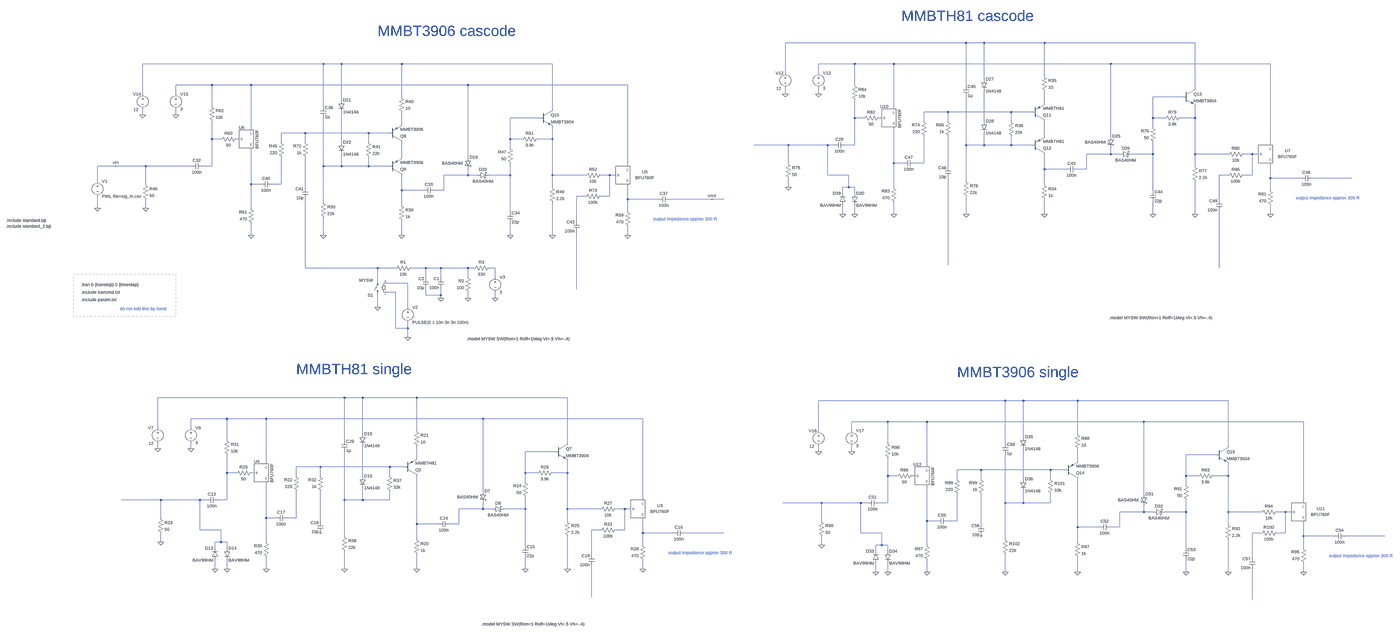
[diagram p0: schematic tp_study.asc, whole sheet]
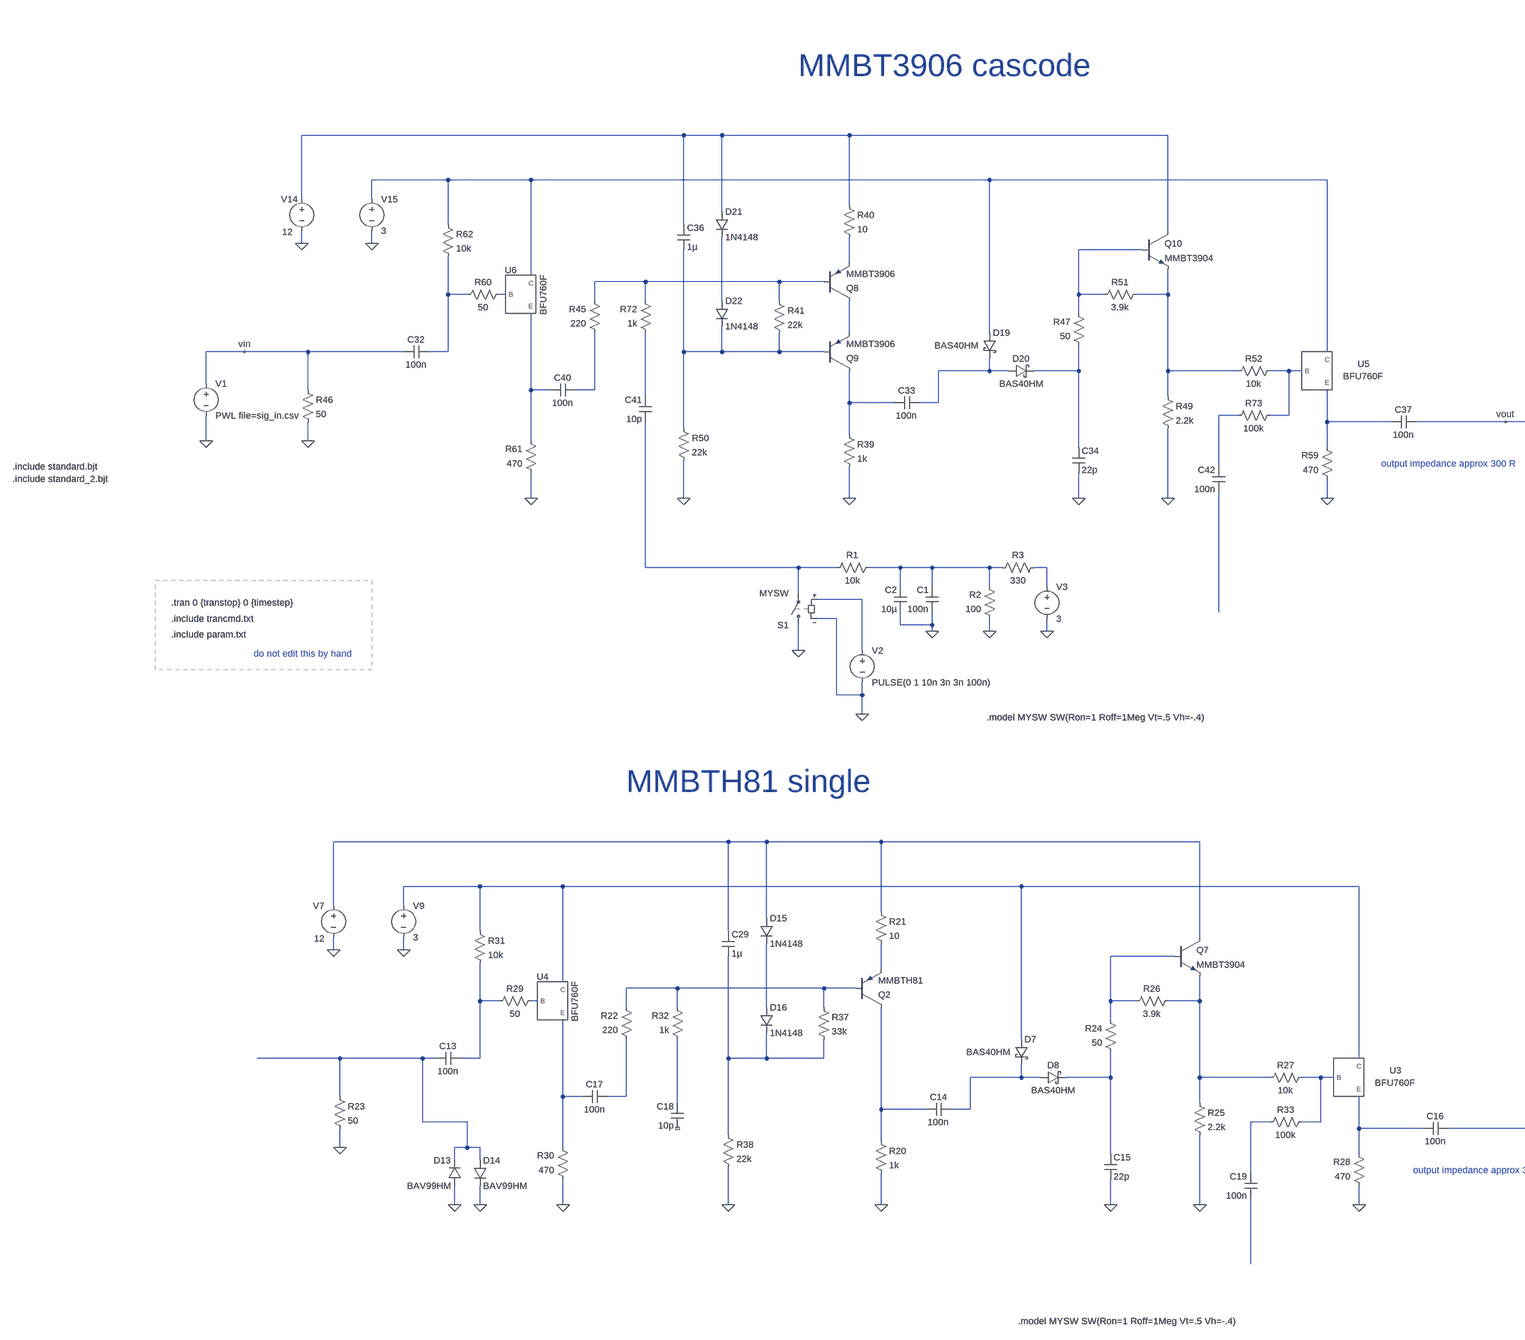
[diagram p1: schematic tp_study.asc, part, row 1 of 1, column 1 of 2]
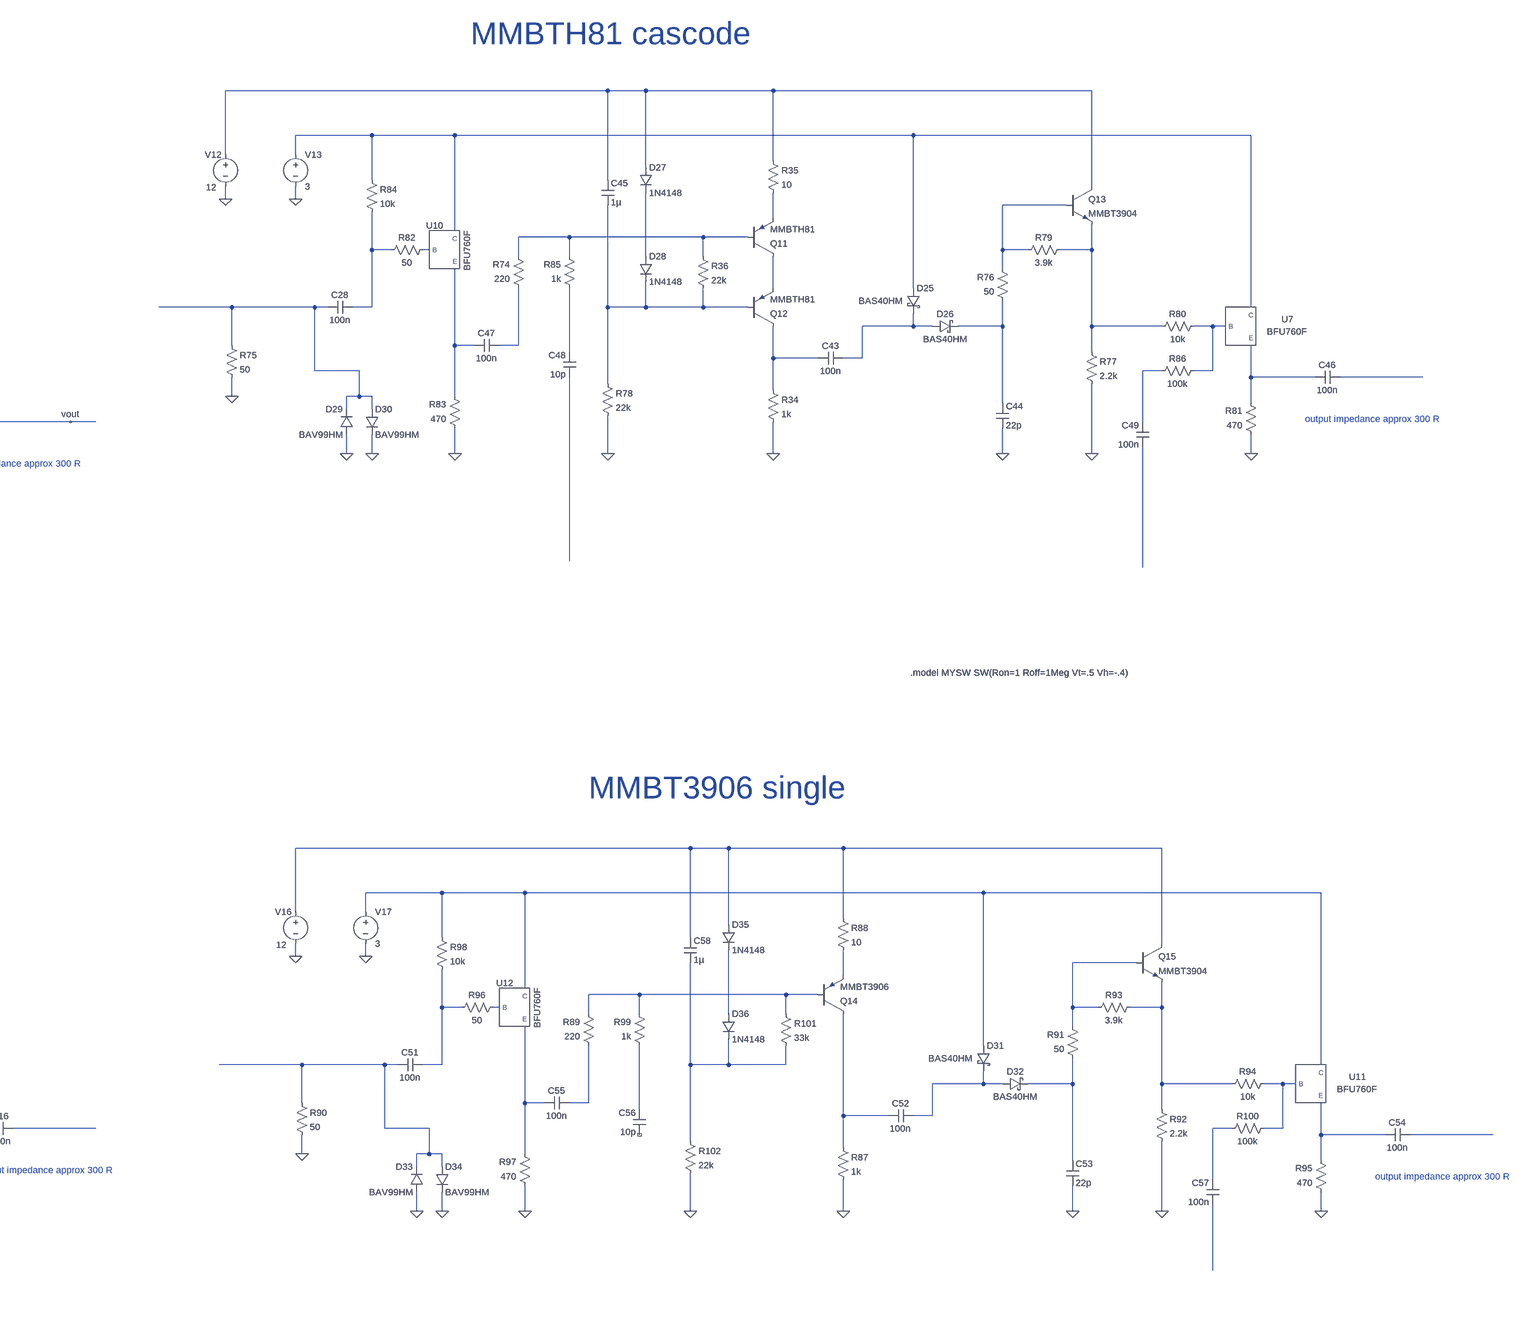
[diagram p2: schematic tp_study.asc, part, row 1 of 1, column 2 of 2]
tp_study.asc, the LTspice schematic file:
Version 4
SHEET 1 25452 10420
WIRE 23152 3536 22192 3536
WIRE 23248 3536 23152 3536
WIRE 23568 3536 23248 3536
WIRE 24368 3536 23568 3536
WIRE 19296 3648 18336 3648
WIRE 19392 3648 19296 3648
WIRE 19712 3648 19392 3648
WIRE 20512 3648 19712 3648
WIRE 22560 3648 22368 3648
WIRE 22768 3648 22560 3648
WIRE 23920 3648 22768 3648
WIRE 24768 3648 23920 3648
WIRE 22192 3696 22192 3536
WIRE 22368 3696 22368 3648
WIRE 23568 3712 23568 3536
WIRE 23248 3728 23248 3536
WIRE 18704 3760 18512 3760
WIRE 18912 3760 18704 3760
WIRE 20064 3760 18912 3760
WIRE 20912 3760 20064 3760
WIRE 22560 3760 22560 3648
WIRE 23152 3760 23152 3536
WIRE 24368 3776 24368 3536
WIRE 18336 3808 18336 3648
WIRE 18512 3808 18512 3760
WIRE 22192 3808 22192 3776
WIRE 22368 3808 22368 3776
WIRE 19712 3824 19712 3648
WIRE 24304 3824 24144 3824
WIRE 19392 3840 19392 3648
WIRE 23568 3856 23568 3792
WIRE 18704 3872 18704 3760
WIRE 19296 3872 19296 3648
WIRE 20512 3888 20512 3648
WIRE 22768 3888 22768 3648
WIRE 23056 3904 22928 3904
WIRE 23392 3904 23056 3904
WIRE 23504 3904 23392 3904
WIRE 18336 3920 18336 3888
WIRE 18512 3920 18512 3888
WIRE 20448 3936 20288 3936
WIRE 22560 3936 22560 3840
WIRE 22608 3936 22560 3936
WIRE 22704 3936 22688 3936
WIRE 24144 3936 24144 3824
WIRE 24208 3936 24144 3936
WIRE 24368 3936 24368 3872
WIRE 24368 3936 24288 3936
WIRE 22928 3952 22928 3904
WIRE 23056 3952 23056 3904
WIRE 23248 3952 23248 3792
WIRE 23392 3952 23392 3904
WIRE 19712 3968 19712 3904
WIRE 24144 3984 24144 3936
WIRE 18912 4000 18912 3760
WIRE 19200 4016 19072 4016
WIRE 19536 4016 19200 4016
WIRE 19648 4016 19536 4016
WIRE 23568 4032 23568 3952
WIRE 23920 4032 23920 3648
WIRE 18704 4048 18704 3952
WIRE 18752 4048 18704 4048
WIRE 18848 4048 18832 4048
WIRE 20288 4048 20288 3936
WIRE 20352 4048 20288 4048
WIRE 20512 4048 20512 3984
WIRE 20512 4048 20432 4048
WIRE 19072 4064 19072 4016
WIRE 19200 4064 19200 4016
WIRE 19392 4064 19392 3904
WIRE 19536 4064 19536 4016
WIRE 22208 4080 22000 4080
WIRE 22416 4080 22208 4080
WIRE 22448 4080 22416 4080
WIRE 22560 4080 22560 3936
WIRE 22560 4080 22512 4080
WIRE 23152 4080 23152 3824
WIRE 23248 4080 23248 4016
WIRE 23248 4080 23152 4080
WIRE 23392 4080 23392 4032
WIRE 23392 4080 23248 4080
WIRE 23504 4080 23392 4080
WIRE 24768 4080 24768 3648
WIRE 20288 4096 20288 4048
WIRE 23920 4128 23920 4096
WIRE 23920 4128 23792 4128
WIRE 23968 4128 23920 4128
WIRE 24144 4128 24144 4064
WIRE 24144 4128 24032 4128
WIRE 24368 4128 24368 3936
WIRE 24544 4128 24368 4128
WIRE 24672 4128 24624 4128
WIRE 24704 4128 24672 4128
WIRE 19712 4144 19712 4064
WIRE 20064 4144 20064 3760
WIRE 22208 4176 22208 4080
WIRE 22768 4176 22768 3984
WIRE 22816 4176 22768 4176
WIRE 22928 4176 22928 4032
WIRE 22928 4176 22880 4176
WIRE 18192 4192 18096 4192
WIRE 18352 4192 18192 4192
WIRE 18592 4192 18352 4192
WIRE 18704 4192 18704 4048
WIRE 18704 4192 18656 4192
WIRE 19296 4192 19296 3936
WIRE 19392 4192 19392 4128
WIRE 19392 4192 19296 4192
WIRE 19536 4192 19536 4144
WIRE 19536 4192 19392 4192
WIRE 19648 4192 19536 4192
WIRE 20912 4192 20912 3760
WIRE 23056 4192 23056 4032
WIRE 24368 4192 24368 4128
WIRE 23568 4208 23568 4128
WIRE 23680 4208 23568 4208
WIRE 23792 4208 23792 4128
WIRE 23792 4208 23744 4208
WIRE 20064 4240 20064 4208
WIRE 20064 4240 19936 4240
WIRE 20112 4240 20064 4240
WIRE 20288 4240 20288 4176
WIRE 20288 4240 20176 4240
WIRE 20512 4240 20512 4048
WIRE 20688 4240 20512 4240
WIRE 20816 4240 20768 4240
WIRE 20848 4240 20816 4240
WIRE 22416 4240 22416 4080
WIRE 22528 4240 22416 4240
WIRE 24544 4240 24496 4240
WIRE 24672 4240 24672 4128
WIRE 24672 4240 24624 4240
WIRE 24768 4256 24768 4176
WIRE 24928 4256 24768 4256
WIRE 25200 4256 24992 4256
WIRE 18096 4272 18096 4192
WIRE 23152 4272 23152 4080
WIRE 18352 4288 18352 4192
WIRE 18912 4288 18912 4096
WIRE 18960 4288 18912 4288
WIRE 19072 4288 19072 4144
WIRE 19072 4288 19024 4288
WIRE 23568 4288 23568 4208
WIRE 19200 4304 19200 4144
WIRE 20512 4304 20512 4240
WIRE 22208 4304 22208 4256
WIRE 22528 4304 22528 4240
WIRE 22528 4304 22496 4304
WIRE 22560 4304 22528 4304
WIRE 22768 4304 22768 4176
WIRE 19712 4320 19712 4240
WIRE 19824 4320 19712 4320
WIRE 19936 4320 19936 4240
WIRE 19936 4320 19888 4320
WIRE 24144 4320 24144 4128
WIRE 24768 4320 24768 4256
WIRE 22496 4336 22496 4304
WIRE 22560 4336 22560 4304
WIRE 20688 4352 20640 4352
WIRE 20816 4352 20816 4240
WIRE 20816 4352 20768 4352
WIRE 20912 4368 20912 4288
WIRE 21072 4368 20912 4368
WIRE 21360 4368 21136 4368
WIRE 21424 4368 21360 4368
WIRE 24496 4368 24496 4240
WIRE 19296 4384 19296 4192
WIRE 19712 4400 19712 4320
WIRE 18096 4416 18096 4352
WIRE 18352 4416 18352 4368
WIRE 18912 4416 18912 4288
WIRE 20288 4432 20288 4240
WIRE 20912 4432 20912 4368
WIRE 22496 4448 22496 4400
WIRE 22560 4448 22560 4400
WIRE 22768 4448 22768 4384
WIRE 23152 4448 23152 4352
WIRE 23568 4448 23568 4368
WIRE 24144 4448 24144 4384
WIRE 24368 4448 24368 4272
WIRE 24768 4448 24768 4400
WIRE 20640 4480 20640 4352
WIRE 18912 4560 18912 4496
WIRE 19296 4560 19296 4464
WIRE 19712 4560 19712 4480
WIRE 20288 4560 20288 4496
WIRE 20512 4560 20512 4384
WIRE 20912 4560 20912 4512
WIRE 23056 4784 23056 4256
WIRE 19200 4800 19200 4368
WIRE 19584 4800 19200 4800
WIRE 19680 4800 19584 4800
WIRE 19840 4800 19760 4800
WIRE 19920 4800 19840 4800
WIRE 20064 4800 19920 4800
WIRE 20096 4800 20064 4800
WIRE 20208 4800 20176 4800
WIRE 24496 4800 24496 4432
WIRE 19840 4848 19840 4800
WIRE 19920 4848 19920 4800
WIRE 20064 4848 20064 4800
WIRE 20208 4848 20208 4800
WIRE 19584 4864 19584 4800
WIRE 19744 4880 19632 4880
WIRE 20640 4912 20640 4544
WIRE 19680 4928 19632 4928
WIRE 19840 4944 19840 4912
WIRE 19920 4944 19920 4912
WIRE 19920 4944 19840 4944
WIRE 19920 4960 19920 4944
WIRE 20064 4960 20064 4928
WIRE 20208 4960 20208 4928
WIRE 19584 5008 19584 4944
WIRE 19744 5008 19744 4880
WIRE 19680 5120 19680 4928
WIRE 19744 5120 19744 5088
WIRE 19744 5120 19680 5120
WIRE 19744 5168 19744 5120
WIRE 19408 5664 18416 5664
WIRE 19504 5664 19408 5664
WIRE 19792 5664 19504 5664
WIRE 20592 5664 19792 5664
WIRE 23360 5680 22368 5680
WIRE 23456 5680 23360 5680
WIRE 23744 5680 23456 5680
WIRE 24544 5680 23744 5680
WIRE 18784 5776 18592 5776
WIRE 18992 5776 18784 5776
WIRE 20144 5776 18992 5776
WIRE 20992 5776 20144 5776
WIRE 22736 5792 22544 5792
WIRE 22944 5792 22736 5792
WIRE 24096 5792 22944 5792
WIRE 24944 5792 24096 5792
WIRE 18416 5824 18416 5664
WIRE 18592 5824 18592 5776
WIRE 19792 5840 19792 5664
WIRE 22368 5840 22368 5680
WIRE 22544 5840 22544 5792
WIRE 19504 5856 19504 5664
WIRE 23744 5856 23744 5680
WIRE 23456 5872 23456 5680
WIRE 18784 5888 18784 5776
WIRE 19408 5888 19408 5664
WIRE 20592 5904 20592 5664
WIRE 22736 5904 22736 5792
WIRE 23360 5904 23360 5680
WIRE 24544 5920 24544 5680
WIRE 18416 5936 18416 5904
WIRE 18592 5936 18592 5904
WIRE 20528 5952 20368 5952
WIRE 22368 5952 22368 5920
WIRE 22544 5952 22544 5920
WIRE 24480 5968 24320 5968
WIRE 19792 5984 19792 5920
WIRE 23744 6000 23744 5936
WIRE 18992 6016 18992 5776
WIRE 19280 6032 19152 6032
WIRE 19648 6032 19280 6032
WIRE 19728 6032 19648 6032
WIRE 22944 6032 22944 5792
WIRE 23232 6048 23104 6048
WIRE 23600 6048 23232 6048
WIRE 23680 6048 23600 6048
WIRE 18784 6064 18784 5968
WIRE 18832 6064 18784 6064
WIRE 18928 6064 18912 6064
WIRE 20368 6064 20368 5952
WIRE 20432 6064 20368 6064
WIRE 20592 6064 20592 6000
WIRE 20592 6064 20512 6064
WIRE 19152 6080 19152 6032
WIRE 19280 6080 19280 6032
WIRE 19504 6080 19504 5920
WIRE 19648 6080 19648 6032
WIRE 22736 6080 22736 5984
WIRE 22784 6080 22736 6080
WIRE 22880 6080 22864 6080
WIRE 24320 6080 24320 5968
WIRE 24384 6080 24320 6080
WIRE 24544 6080 24544 6016
WIRE 24544 6080 24464 6080
WIRE 23104 6096 23104 6048
WIRE 23232 6096 23232 6048
WIRE 23456 6096 23456 5936
WIRE 23600 6096 23600 6048
WIRE 20368 6112 20368 6064
WIRE 24320 6128 24320 6080
WIRE 20144 6160 20144 5776
WIRE 24096 6176 24096 5792
WIRE 18432 6208 18224 6208
WIRE 18640 6208 18432 6208
WIRE 18672 6208 18640 6208
WIRE 18784 6208 18784 6064
WIRE 18784 6208 18736 6208
WIRE 19408 6208 19408 5952
WIRE 19504 6208 19504 6144
WIRE 19504 6208 19408 6208
WIRE 19648 6208 19648 6160
WIRE 19648 6208 19504 6208
WIRE 20992 6208 20992 5776
WIRE 22384 6224 22176 6224
WIRE 22592 6224 22384 6224
WIRE 22624 6224 22592 6224
WIRE 22736 6224 22736 6080
WIRE 22736 6224 22688 6224
WIRE 23360 6224 23360 5968
WIRE 23456 6224 23456 6160
WIRE 23456 6224 23360 6224
WIRE 23600 6224 23600 6176
WIRE 23600 6224 23456 6224
WIRE 24944 6224 24944 5792
WIRE 20144 6256 20144 6224
WIRE 20144 6256 20016 6256
WIRE 20192 6256 20144 6256
WIRE 20368 6256 20368 6192
WIRE 20368 6256 20256 6256
WIRE 20592 6256 20592 6064
WIRE 20768 6256 20592 6256
WIRE 20896 6256 20848 6256
WIRE 20928 6256 20896 6256
WIRE 24096 6272 24096 6240
WIRE 24096 6272 23968 6272
WIRE 24144 6272 24096 6272
WIRE 24320 6272 24320 6208
WIRE 24320 6272 24208 6272
WIRE 24544 6272 24544 6080
WIRE 24720 6272 24544 6272
WIRE 24848 6272 24800 6272
WIRE 24880 6272 24848 6272
WIRE 18432 6304 18432 6208
WIRE 18992 6304 18992 6112
WIRE 19040 6304 18992 6304
WIRE 19152 6304 19152 6160
WIRE 19152 6304 19104 6304
WIRE 19280 6320 19280 6160
WIRE 20592 6320 20592 6256
WIRE 22384 6320 22384 6224
WIRE 22944 6320 22944 6128
WIRE 22992 6320 22944 6320
WIRE 23104 6320 23104 6176
WIRE 23104 6320 23056 6320
WIRE 19792 6336 19792 6080
WIRE 19904 6336 19792 6336
WIRE 20016 6336 20016 6256
WIRE 20016 6336 19968 6336
WIRE 23232 6336 23232 6176
WIRE 24544 6336 24544 6272
WIRE 23744 6352 23744 6096
WIRE 23856 6352 23744 6352
WIRE 23968 6352 23968 6272
WIRE 23968 6352 23920 6352
WIRE 18640 6368 18640 6208
WIRE 18752 6368 18640 6368
WIRE 20768 6368 20720 6368
WIRE 20896 6368 20896 6256
WIRE 20896 6368 20848 6368
WIRE 20992 6384 20992 6304
WIRE 21152 6384 20992 6384
WIRE 21424 6384 21216 6384
WIRE 22592 6384 22592 6224
WIRE 22704 6384 22592 6384
WIRE 24720 6384 24672 6384
WIRE 24848 6384 24848 6272
WIRE 24848 6384 24800 6384
WIRE 19408 6400 19408 6208
WIRE 24944 6400 24944 6320
WIRE 25104 6400 24944 6400
WIRE 25376 6400 25168 6400
WIRE 19792 6416 19792 6336
WIRE 23360 6416 23360 6224
WIRE 18432 6432 18432 6384
WIRE 18752 6432 18752 6368
WIRE 18752 6432 18720 6432
WIRE 18784 6432 18752 6432
WIRE 18992 6432 18992 6304
WIRE 23744 6432 23744 6352
WIRE 20368 6448 20368 6256
WIRE 20992 6448 20992 6384
WIRE 22384 6448 22384 6400
WIRE 22704 6448 22704 6384
WIRE 22704 6448 22672 6448
WIRE 22736 6448 22704 6448
WIRE 22944 6448 22944 6320
WIRE 18720 6464 18720 6432
WIRE 18784 6464 18784 6432
WIRE 24320 6464 24320 6272
WIRE 24944 6464 24944 6400
WIRE 22672 6480 22672 6448
WIRE 22736 6480 22736 6448
WIRE 20720 6496 20720 6368
WIRE 24672 6512 24672 6384
WIRE 18720 6576 18720 6528
WIRE 18784 6576 18784 6528
WIRE 18992 6576 18992 6512
WIRE 19408 6576 19408 6480
WIRE 19792 6576 19792 6496
WIRE 20368 6576 20368 6512
WIRE 20592 6576 20592 6400
WIRE 20992 6576 20992 6528
WIRE 22672 6592 22672 6544
WIRE 22736 6592 22736 6544
WIRE 22944 6592 22944 6528
WIRE 23360 6592 23360 6496
WIRE 23744 6592 23744 6512
WIRE 24320 6592 24320 6528
WIRE 24544 6592 24544 6416
WIRE 24944 6592 24944 6544
WIRE 20720 6928 20720 6560
WIRE 24672 6944 24672 6576
FLAG 19792 6576 0
FLAG 18432 6432 0
FLAG 20368 6576 0
FLAG 20592 6576 0
FLAG 20992 6576 0
FLAG 18784 6576 0
FLAG 18720 6576 0
FLAG 18592 5936 0
FLAG 18992 6576 0
FLAG 18416 5936 0
FLAG 19408 6576 0
FLAG 19712 4560 0
FLAG 18352 4416 0
FLAG 20288 4560 0
FLAG 19296 4560 0
FLAG 20512 4560 0
FLAG 20912 4560 0
FLAG 18512 3920 0
FLAG 18912 4560 0
FLAG 18336 3920 0
FLAG 23568 4448 0
FLAG 22208 4304 0
FLAG 24144 4448 0
FLAG 23152 4448 0
FLAG 24368 4448 0
FLAG 24768 4448 0
FLAG 22560 4448 0
FLAG 22496 4448 0
FLAG 22368 3808 0
FLAG 22768 4448 0
FLAG 22192 3808 0
FLAG 23744 6592 0
FLAG 22384 6448 0
FLAG 24320 6592 0
FLAG 24544 6592 0
FLAG 24944 6592 0
FLAG 22736 6592 0
FLAG 22672 6592 0
FLAG 22544 5952 0
FLAG 22944 6592 0
FLAG 22368 5952 0
FLAG 23360 6592 0
FLAG 18192 4192 vin
FLAG 18096 4416 0
FLAG 21360 4368 vout
FLAG 19584 5008 0
FLAG 19744 5168 0
FLAG 20208 4960 0
FLAG 20064 4960 0
FLAG 19920 4960 0
SYMBOL pnp 19728 6080 M180
SYMATTR InstName Q2
SYMATTR Value MMBTH81
SYMBOL res 19776 6400 R0
SYMATTR InstName R20
SYMATTR Value 1k
SYMBOL res 19776 5824 R0
SYMATTR InstName R21
SYMATTR Value 10
SYMBOL voltage 18416 5808 R0
WINDOW 123 0 0 Left 2
WINDOW 39 14 99 Left 2
WINDOW 0 -52 16 Left 2
WINDOW 3 -49 98 Left 2
SYMATTR InstName V7
SYMATTR Value 12
SYMBOL res 19168 6176 R180
WINDOW 0 36 76 Left 2
WINDOW 3 36 40 Left 2
SYMATTR InstName R22
SYMATTR Value 220
SYMBOL res 18416 6288 R0
SYMATTR InstName R23
SYMATTR Value 50
SYMBOL cap 18736 6192 R90
WINDOW 0 0 32 VBottom 2
WINDOW 3 32 32 VTop 2
SYMATTR InstName C13
SYMATTR Value 100n
SYMBOL cap 19968 6320 R90
WINDOW 0 0 32 VBottom 2
WINDOW 3 32 32 VTop 2
SYMATTR InstName C14
SYMATTR Value 100n
SYMBOL cap 20352 6448 R0
SYMATTR InstName C15
SYMATTR Value 22p
SYMBOL schottky 20128 6160 R0
WINDOW 3 -122 32 Left 2
SYMATTR Value BAS40HM
SYMATTR InstName D7
SYMATTR Description Diode
SYMATTR Type diode
SYMBOL schottky 20192 6272 R270
WINDOW 3 0 32 VBottom 2
WINDOW 0 32 32 VTop 2
SYMATTR Value BAS40HM
SYMATTR InstName D8
SYMATTR Description Diode
SYMATTR Type diode
SYMBOL res 20384 6208 R180
WINDOW 0 36 76 Left 2
WINDOW 3 36 40 Left 2
SYMATTR InstName R24
SYMATTR Value 50
SYMBOL res 20576 6304 R0
SYMATTR InstName R25
SYMATTR Value 2.2k
SYMBOL npn 20528 5904 R0
SYMATTR InstName Q7
SYMATTR Value MMBT3904
SYMBOL res 20528 6048 R90
WINDOW 0 0 56 VBottom 2
WINDOW 3 32 56 VTop 2
SYMATTR InstName R26
SYMATTR Value 3.9k
SYMBOL BFU760F 20960 6256 R0
SYMATTR InstName U3
SYMBOL res 20864 6240 R90
WINDOW 0 0 56 VBottom 2
WINDOW 3 32 56 VTop 2
SYMATTR InstName R27
SYMATTR Value 10k
SYMBOL res 21008 6544 R180
WINDOW 0 36 76 Left 2
WINDOW 3 36 40 Left 2
SYMATTR InstName R28
SYMATTR Value 470
SYMBOL cap 21216 6368 R90
WINDOW 0 0 32 VBottom 2
WINDOW 3 32 32 VTop 2
SYMATTR InstName C16
SYMATTR Value 100n
SYMBOL diode 18736 6528 R180
WINDOW 0 24 64 Left 2
WINDOW 3 24 0 Left 2
SYMATTR InstName D13
SYMATTR Value BAV99HM
SYMBOL diode 18768 6464 R0
SYMATTR InstName D14
SYMATTR Value BAV99HM
SYMBOL BFU760F 18960 6064 R0
WINDOW 0 -18 -46 Bottom 2
WINDOW 3 47 1 VTop 2
SYMATTR InstName U4
SYMBOL res 18928 6048 R90
WINDOW 0 0 56 VBottom 2
WINDOW 3 32 56 VTop 2
SYMATTR InstName R29
SYMATTR Value 50
SYMBOL res 19008 6528 R180
WINDOW 0 36 76 Left 2
WINDOW 3 36 40 Left 2
SYMATTR InstName R30
SYMATTR Value 470
SYMBOL voltage 18592 5808 R0
SYMATTR InstName V9
SYMATTR Value 3
SYMBOL cap 19104 6288 R90
WINDOW 0 0 32 VBottom 2
WINDOW 3 32 32 VTop 2
SYMATTR InstName C17
SYMATTR Value 100n
SYMBOL res 18768 5872 R0
SYMATTR InstName R31
SYMATTR Value 10k
SYMBOL res 19296 6176 R180
WINDOW 0 36 76 Left 2
WINDOW 3 36 40 Left 2
SYMATTR InstName R32
SYMATTR Value 1k
SYMBOL cap 19296 6384 R180
WINDOW 0 24 56 Left 2
WINDOW 3 24 8 Left 2
SYMATTR InstName C18
SYMATTR Value 10p
SYMBOL res 20864 6352 R90
WINDOW 0 0 56 VBottom 2
WINDOW 3 32 56 VTop 2
SYMATTR InstName R33
SYMATTR Value 100k
SYMBOL cap 20736 6560 R180
WINDOW 0 24 56 Left 2
WINDOW 3 24 8 Left 2
SYMATTR InstName C19
SYMATTR Value 100n
SYMBOL res 19632 6064 R0
SYMATTR InstName R37
SYMATTR Value 33k
SYMBOL diode 19488 5856 R0
SYMATTR InstName D15
SYMATTR Value 1N4148
SYMBOL diode 19488 6080 R0
SYMATTR InstName D16
SYMATTR Value 1N4148
SYMBOL cap 19392 5888 R0
SYMATTR InstName C29
SYMATTR Value 1µ
SYMBOL res 19392 6384 R0
SYMATTR InstName R38
SYMATTR Value 22k
SYMBOL pnp 19648 4064 M180
SYMATTR InstName Q8
SYMATTR Value MMBT3906
SYMBOL pnp 19648 4240 M180
SYMATTR InstName Q9
SYMATTR Value MMBT3906
SYMBOL res 19696 4384 R0
SYMATTR InstName R39
SYMATTR Value 1k
SYMBOL res 19696 3808 R0
SYMATTR InstName R40
SYMATTR Value 10
SYMBOL voltage 18336 3792 R0
WINDOW 123 0 0 Left 2
WINDOW 39 14 99 Left 2
WINDOW 0 -52 16 Left 2
WINDOW 3 -49 98 Left 2
SYMATTR InstName V14
SYMATTR Value 12
SYMBOL res 19520 4048 R0
SYMATTR InstName R41
SYMATTR Value 22k
SYMBOL res 19088 4160 R180
WINDOW 0 36 76 Left 2
WINDOW 3 36 40 Left 2
SYMATTR InstName R45
SYMATTR Value 220
SYMBOL res 18336 4272 R0
SYMATTR InstName R46
SYMATTR Value 50
SYMBOL cap 18656 4176 R90
WINDOW 0 0 32 VBottom 2
WINDOW 3 32 32 VTop 2
SYMATTR InstName C32
SYMATTR Value 100n
SYMBOL cap 19888 4304 R90
WINDOW 0 0 32 VBottom 2
WINDOW 3 32 32 VTop 2
SYMATTR InstName C33
SYMATTR Value 100n
SYMBOL cap 20272 4432 R0
SYMATTR InstName C34
SYMATTR Value 22p
SYMBOL schottky 20048 4144 R0
WINDOW 3 -122 32 Left 2
SYMATTR Value BAS40HM
SYMATTR InstName D19
SYMATTR Description Diode
SYMATTR Type diode
SYMBOL schottky 20112 4256 R270
WINDOW 3 0 32 VBottom 2
WINDOW 0 32 32 VTop 2
SYMATTR Value BAS40HM
SYMATTR InstName D20
SYMATTR Description Diode
SYMATTR Type diode
SYMBOL res 20304 4192 R180
WINDOW 0 36 76 Left 2
WINDOW 3 36 40 Left 2
SYMATTR InstName R47
SYMATTR Value 50
SYMBOL res 20496 4288 R0
SYMATTR InstName R49
SYMATTR Value 2.2k
SYMBOL npn 20448 3888 R0
SYMATTR InstName Q10
SYMATTR Value MMBT3904
SYMBOL diode 19376 3840 R0
SYMATTR InstName D21
SYMATTR Value 1N4148
SYMBOL diode 19376 4064 R0
SYMATTR InstName D22
SYMATTR Value 1N4148
SYMBOL cap 19280 3872 R0
SYMATTR InstName C36
SYMATTR Value 1µ
SYMBOL res 19280 4368 R0
SYMATTR InstName R50
SYMATTR Value 22k
SYMBOL res 20448 4032 R90
WINDOW 0 0 56 VBottom 2
WINDOW 3 32 56 VTop 2
SYMATTR InstName R51
SYMATTR Value 3.9k
SYMBOL BFU760F 20880 4240 R0
SYMATTR InstName U5
SYMBOL res 20784 4224 R90
WINDOW 0 0 56 VBottom 2
WINDOW 3 32 56 VTop 2
SYMATTR InstName R52
SYMATTR Value 10k
SYMBOL res 20928 4528 R180
WINDOW 0 36 76 Left 2
WINDOW 3 36 40 Left 2
SYMATTR InstName R59
SYMATTR Value 470
SYMBOL cap 21136 4352 R90
WINDOW 0 0 32 VBottom 2
WINDOW 3 32 32 VTop 2
SYMATTR InstName C37
SYMATTR Value 100n
SYMBOL BFU760F 18880 4048 R0
WINDOW 0 -18 -46 Bottom 2
WINDOW 3 47 1 VTop 2
SYMATTR InstName U6
SYMBOL res 18848 4032 R90
WINDOW 0 0 56 VBottom 2
WINDOW 3 32 56 VTop 2
SYMATTR InstName R60
SYMATTR Value 50
SYMBOL res 18928 4512 R180
WINDOW 0 36 76 Left 2
WINDOW 3 36 40 Left 2
SYMATTR InstName R61
SYMATTR Value 470
SYMBOL voltage 18512 3792 R0
SYMATTR InstName V15
SYMATTR Value 3
SYMBOL cap 19024 4272 R90
WINDOW 0 0 32 VBottom 2
WINDOW 3 32 32 VTop 2
SYMATTR InstName C40
SYMATTR Value 100n
SYMBOL res 18688 3856 R0
SYMATTR InstName R62
SYMATTR Value 10k
SYMBOL res 19216 4160 R180
WINDOW 0 36 76 Left 2
WINDOW 3 36 40 Left 2
SYMATTR InstName R72
SYMATTR Value 1k
SYMBOL cap 19216 4368 R180
WINDOW 0 24 56 Left 2
WINDOW 3 24 8 Left 2
SYMATTR InstName C41
SYMATTR Value 10p
SYMBOL res 20784 4336 R90
WINDOW 0 0 56 VBottom 2
WINDOW 3 32 56 VTop 2
SYMATTR InstName R73
SYMATTR Value 100k
SYMBOL cap 20656 4544 R180
WINDOW 0 24 56 Left 2
WINDOW 3 24 8 Left 2
SYMATTR InstName C42
SYMATTR Value 100n
SYMBOL pnp 23504 3952 M180
SYMATTR InstName Q11
SYMATTR Value MMBTH81
SYMBOL pnp 23504 4128 M180
SYMATTR InstName Q12
SYMATTR Value MMBTH81
SYMBOL res 23552 4272 R0
SYMATTR InstName R34
SYMATTR Value 1k
SYMBOL res 23552 3696 R0
SYMATTR InstName R35
SYMATTR Value 10
SYMBOL voltage 22192 3680 R0
WINDOW 123 0 0 Left 2
WINDOW 39 14 99 Left 2
WINDOW 0 -52 16 Left 2
WINDOW 3 -49 98 Left 2
SYMATTR InstName V12
SYMATTR Value 12
SYMBOL res 23376 3936 R0
SYMATTR InstName R36
SYMATTR Value 22k
SYMBOL res 22944 4048 R180
WINDOW 0 36 76 Left 2
WINDOW 3 36 40 Left 2
SYMATTR InstName R74
SYMATTR Value 220
SYMBOL res 22192 4160 R0
SYMATTR InstName R75
SYMATTR Value 50
SYMBOL cap 22512 4064 R90
WINDOW 0 0 32 VBottom 2
WINDOW 3 32 32 VTop 2
SYMATTR InstName C28
SYMATTR Value 100n
SYMBOL cap 23744 4192 R90
WINDOW 0 0 32 VBottom 2
WINDOW 3 32 32 VTop 2
SYMATTR InstName C43
SYMATTR Value 100n
SYMBOL cap 24128 4320 R0
SYMATTR InstName C44
SYMATTR Value 22p
SYMBOL schottky 23904 4032 R0
WINDOW 3 -122 32 Left 2
SYMATTR Value BAS40HM
SYMATTR InstName D25
SYMATTR Description Diode
SYMATTR Type diode
SYMBOL schottky 23968 4144 R270
WINDOW 3 0 32 VBottom 2
WINDOW 0 32 32 VTop 2
SYMATTR Value BAS40HM
SYMATTR InstName D26
SYMATTR Description Diode
SYMATTR Type diode
SYMBOL res 24160 4080 R180
WINDOW 0 36 76 Left 2
WINDOW 3 36 40 Left 2
SYMATTR InstName R76
SYMATTR Value 50
SYMBOL res 24352 4176 R0
SYMATTR InstName R77
SYMATTR Value 2.2k
SYMBOL npn 24304 3776 R0
SYMATTR InstName Q13
SYMATTR Value MMBT3904
SYMBOL diode 23232 3728 R0
SYMATTR InstName D27
SYMATTR Value 1N4148
SYMBOL diode 23232 3952 R0
SYMATTR InstName D28
SYMATTR Value 1N4148
SYMBOL cap 23136 3760 R0
SYMATTR InstName C45
SYMATTR Value 1µ
SYMBOL res 23136 4256 R0
SYMATTR InstName R78
SYMATTR Value 22k
SYMBOL res 24304 3920 R90
WINDOW 0 0 56 VBottom 2
WINDOW 3 32 56 VTop 2
SYMATTR InstName R79
SYMATTR Value 3.9k
SYMBOL BFU760F 24736 4128 R0
SYMATTR InstName U7
SYMBOL res 24640 4112 R90
WINDOW 0 0 56 VBottom 2
WINDOW 3 32 56 VTop 2
SYMATTR InstName R80
SYMATTR Value 10k
SYMBOL res 24784 4416 R180
WINDOW 0 36 76 Left 2
WINDOW 3 36 40 Left 2
SYMATTR InstName R81
SYMATTR Value 470
SYMBOL cap 24992 4240 R90
WINDOW 0 0 32 VBottom 2
WINDOW 3 32 32 VTop 2
SYMATTR InstName C46
SYMATTR Value 100n
SYMBOL diode 22512 4400 R180
WINDOW 0 24 64 Left 2
WINDOW 3 24 0 Left 2
SYMATTR InstName D29
SYMATTR Value BAV99HM
SYMBOL diode 22544 4336 R0
SYMATTR InstName D30
SYMATTR Value BAV99HM
SYMBOL BFU760F 22736 3936 R0
WINDOW 0 -18 -46 Bottom 2
WINDOW 3 47 1 VTop 2
SYMATTR InstName U10
SYMBOL res 22704 3920 R90
WINDOW 0 0 56 VBottom 2
WINDOW 3 32 56 VTop 2
SYMATTR InstName R82
SYMATTR Value 50
SYMBOL res 22784 4400 R180
WINDOW 0 36 76 Left 2
WINDOW 3 36 40 Left 2
SYMATTR InstName R83
SYMATTR Value 470
SYMBOL voltage 22368 3680 R0
SYMATTR InstName V13
SYMATTR Value 3
SYMBOL cap 22880 4160 R90
WINDOW 0 0 32 VBottom 2
WINDOW 3 32 32 VTop 2
SYMATTR InstName C47
SYMATTR Value 100n
SYMBOL res 22544 3744 R0
SYMATTR InstName R84
SYMATTR Value 10k
SYMBOL res 23072 4048 R180
WINDOW 0 36 76 Left 2
WINDOW 3 36 40 Left 2
SYMATTR InstName R85
SYMATTR Value 1k
SYMBOL cap 23072 4256 R180
WINDOW 0 24 56 Left 2
WINDOW 3 24 8 Left 2
SYMATTR InstName C48
SYMATTR Value 10p
SYMBOL res 24640 4224 R90
WINDOW 0 0 56 VBottom 2
WINDOW 3 32 56 VTop 2
SYMATTR InstName R86
SYMATTR Value 100k
SYMBOL cap 24512 4432 R180
WINDOW 0 24 56 Left 2
WINDOW 3 24 8 Left 2
SYMATTR InstName C49
SYMATTR Value 100n
SYMBOL pnp 23680 6096 M180
SYMATTR InstName Q14
SYMATTR Value MMBT3906
SYMBOL res 23728 6416 R0
SYMATTR InstName R87
SYMATTR Value 1k
SYMBOL res 23728 5840 R0
SYMATTR InstName R88
SYMATTR Value 10
SYMBOL voltage 22368 5824 R0
WINDOW 123 0 0 Left 2
WINDOW 39 14 99 Left 2
WINDOW 0 -52 16 Left 2
WINDOW 3 -49 98 Left 2
SYMATTR InstName V16
SYMATTR Value 12
SYMBOL res 23120 6192 R180
WINDOW 0 36 76 Left 2
WINDOW 3 36 40 Left 2
SYMATTR InstName R89
SYMATTR Value 220
SYMBOL res 22368 6304 R0
SYMATTR InstName R90
SYMATTR Value 50
SYMBOL cap 22688 6208 R90
WINDOW 0 0 32 VBottom 2
WINDOW 3 32 32 VTop 2
SYMATTR InstName C51
SYMATTR Value 100n
SYMBOL cap 23920 6336 R90
WINDOW 0 0 32 VBottom 2
WINDOW 3 32 32 VTop 2
SYMATTR InstName C52
SYMATTR Value 100n
SYMBOL cap 24304 6464 R0
SYMATTR InstName C53
SYMATTR Value 22p
SYMBOL schottky 24080 6176 R0
WINDOW 3 -122 32 Left 2
SYMATTR Value BAS40HM
SYMATTR InstName D31
SYMATTR Description Diode
SYMATTR Type diode
SYMBOL schottky 24144 6288 R270
WINDOW 3 0 32 VBottom 2
WINDOW 0 32 32 VTop 2
SYMATTR Value BAS40HM
SYMATTR InstName D32
SYMATTR Description Diode
SYMATTR Type diode
SYMBOL res 24336 6224 R180
WINDOW 0 36 76 Left 2
WINDOW 3 36 40 Left 2
SYMATTR InstName R91
SYMATTR Value 50
SYMBOL res 24528 6320 R0
SYMATTR InstName R92
SYMATTR Value 2.2k
SYMBOL npn 24480 5920 R0
SYMATTR InstName Q15
SYMATTR Value MMBT3904
SYMBOL res 24480 6064 R90
WINDOW 0 0 56 VBottom 2
WINDOW 3 32 56 VTop 2
SYMATTR InstName R93
SYMATTR Value 3.9k
SYMBOL BFU760F 24912 6272 R0
SYMATTR InstName U11
SYMBOL res 24816 6256 R90
WINDOW 0 0 56 VBottom 2
WINDOW 3 32 56 VTop 2
SYMATTR InstName R94
SYMATTR Value 10k
SYMBOL res 24960 6560 R180
WINDOW 0 36 76 Left 2
WINDOW 3 36 40 Left 2
SYMATTR InstName R95
SYMATTR Value 470
SYMBOL cap 25168 6384 R90
WINDOW 0 0 32 VBottom 2
WINDOW 3 32 32 VTop 2
SYMATTR InstName C54
SYMATTR Value 100n
SYMBOL diode 22688 6544 R180
WINDOW 0 24 64 Left 2
WINDOW 3 24 0 Left 2
SYMATTR InstName D33
SYMATTR Value BAV99HM
SYMBOL diode 22720 6480 R0
SYMATTR InstName D34
SYMATTR Value BAV99HM
SYMBOL BFU760F 22912 6080 R0
WINDOW 0 -18 -46 Bottom 2
WINDOW 3 47 1 VTop 2
SYMATTR InstName U12
SYMBOL res 22880 6064 R90
WINDOW 0 0 56 VBottom 2
WINDOW 3 32 56 VTop 2
SYMATTR InstName R96
SYMATTR Value 50
SYMBOL res 22960 6544 R180
WINDOW 0 36 76 Left 2
WINDOW 3 36 40 Left 2
SYMATTR InstName R97
SYMATTR Value 470
SYMBOL voltage 22544 5824 R0
SYMATTR InstName V17
SYMATTR Value 3
SYMBOL cap 23056 6304 R90
WINDOW 0 0 32 VBottom 2
WINDOW 3 32 32 VTop 2
SYMATTR InstName C55
SYMATTR Value 100n
SYMBOL res 22720 5888 R0
SYMATTR InstName R98
SYMATTR Value 10k
SYMBOL res 23248 6192 R180
WINDOW 0 36 76 Left 2
WINDOW 3 36 40 Left 2
SYMATTR InstName R99
SYMATTR Value 1k
SYMBOL cap 23248 6400 R180
WINDOW 0 24 56 Left 2
WINDOW 3 24 8 Left 2
SYMATTR InstName C56
SYMATTR Value 10p
SYMBOL res 24816 6368 R90
WINDOW 0 0 56 VBottom 2
WINDOW 3 32 56 VTop 2
SYMATTR InstName R100
SYMATTR Value 100k
SYMBOL cap 24688 6576 R180
WINDOW 0 24 56 Left 2
WINDOW 3 24 8 Left 2
SYMATTR InstName C57
SYMATTR Value 100n
SYMBOL res 23584 6080 R0
SYMATTR InstName R101
SYMATTR Value 33k
SYMBOL diode 23440 5872 R0
SYMATTR InstName D35
SYMATTR Value 1N4148
SYMBOL diode 23440 6096 R0
SYMATTR InstName D36
SYMATTR Value 1N4148
SYMBOL cap 23344 5904 R0
SYMATTR InstName C58
SYMATTR Value 1µ
SYMBOL res 23344 6400 R0
SYMATTR InstName R102
SYMATTR Value 22k
SYMBOL voltage 18096 4256 R0
WINDOW 39 0 0 Left 0
SYMATTR InstName V1
SYMATTR Value PWL file=sig_in.csv
SYMBOL sw 19584 4960 R180
SYMATTR InstName S1
SYMATTR Value MYSW
SYMBOL voltage 19744 4992 R0
WINDOW 123 0 0 Left 0
WINDOW 39 0 0 Left 0
SYMATTR InstName V2
SYMATTR Value PULSE(0 1 10n 3n 3n 100n)
SYMBOL res 19776 4784 R90
WINDOW 0 0 56 VBottom 2
WINDOW 3 32 56 VTop 2
SYMATTR InstName R1
SYMATTR Value 10k
SYMBOL voltage 20208 4832 R0
SYMATTR InstName V3
SYMATTR Value 3
SYMBOL res 20080 4944 R180
WINDOW 0 36 76 Left 2
WINDOW 3 36 40 Left 2
SYMATTR InstName R2
SYMATTR Value 100
SYMBOL res 20080 4816 R270
WINDOW 0 32 56 VTop 2
WINDOW 3 0 56 VBottom 2
SYMATTR InstName R3
SYMATTR Value 330
SYMBOL cap 19936 4912 R180
WINDOW 0 24 56 Left 2
WINDOW 3 24 8 Left 2
SYMATTR InstName C1
SYMATTR Value 100n
SYMBOL cap 19856 4912 R180
WINDOW 0 24 56 Left 2
WINDOW 3 24 8 Left 2
SYMATTR InstName C2
SYMATTR Value 10µ
TEXT 11056 4480 Left 2 !.include standard.bjt\n.include standard_2.bjt
TEXT 21128 6488 Left 2 ;output impedance approx 300 R
TEXT 20136 7192 Left 2 !.model MYSW SW(Ron=1 Roff=1Meg Vt=.5 Vh=-.4)
TEXT 21048 4472 Left 2 ;output impedance approx 300 R
TEXT 20056 5176 Left 2 !.model MYSW SW(Ron=1 Roff=1Meg Vt=.5 Vh=-.4)
TEXT 24904 4360 Left 2 ;output impedance approx 300 R
TEXT 23912 5064 Left 2 !.model MYSW SW(Ron=1 Roff=1Meg Vt=.5 Vh=-.4)
TEXT 19584 3472 Left 6 ;MMBT3906 cascode
TEXT 22808 3392 Left 6 ;MMBTH81 cascode
TEXT 19152 5512 Left 6 ;MMBTH81 single
TEXT 25080 6504 Left 2 ;output impedance approx 300 R
TEXT 23104 5528 Left 6 ;MMBT3906 single
TEXT 18008 4888 Left 2 !.tran 0 {transtop} 0 {timestep}
TEXT 18008 4968 Left 2 !.include param.txt
TEXT 18008 4928 Left 2 !.include trancmd.txt
TEXT 18216 5016 Left 2 ;do not edit this by hand
RECTANGLE Normal 18512 5056 17968 4832 2

The netlist it stands for:
* tp_study.asc
Q2 N083 N058 N056 0 MMBTH81
R20 N083 0 1k
R21 N050 N056 10
V7 N050 0 12
R22 N079 N058 220
R23 N068 0 50
C13 N060 N068 100n
C14 N072 N083 100n
C15 N073 0 22p
D7 N052 N072 BAS40HM
D8 N072 N073 BAS40HM
R24 N073 N054 50
R25 N062 0 2.2k
Q7 N050 N054 N062 0 MMBT3904
R26 N062 N054 3.9k
XU3 N052 N074 N087 BFU760F  ; pins C B E
R27 N074 N062 10k
R28 0 N087 470
C16 N088 N087 100n
D13 0 N068 BAV99HM
D14 N068 0 BAV99HM
XU4 N052 N061 N078 BFU760F  ; pins C B E
R29 N061 N060 50
R30 0 N078 470
V9 N052 0 3
C17 N079 N078 100n
R31 N052 N060 10k
R32 N080 N058 1k
C18 NC_01 N080 10p
R33 N074 N086 100k
C19 N092 N086 100n
R37 N058 N069 33k
D15 N050 N063 1N4148
D16 N063 N069 1N4148
C29 N050 N069 1µ
R38 N069 0 22k
Q8 N025 N014 N013 0 MMBT3906
Q9 N040 N028 N025 0 MMBT3906
R39 N040 0 1k
R40 N002 N013 10
V14 N002 0 12
R41 N014 N028 22k
R45 N038 N014 220
R46 vin 0 50
C32 N016 vin 100n
C33 N031 N040 100n
C34 N032 0 22p
D19 N004 N031 BAS40HM
D20 N031 N032 BAS40HM
R47 N032 N008 50
R49 N018 0 2.2k
Q10 N002 N008 N018 0 MMBT3904
D21 N002 N019 1N4148
D22 N019 N028 1N4148
C36 N002 N028 1µ
R50 N028 0 22k
R51 N018 N008 3.9k
XU5 N004 N033 N042 BFU760F  ; pins C B E
R52 N033 N018 10k
R59 0 N042 470
C37 vout N042 100n
XU6 N004 N017 N037 BFU760F  ; pins C B E
R60 N017 N016 50
R61 0 N037 470
V15 N004 0 3
C40 N038 N037 100n
R62 N004 N016 10k
R72 N039 N014 1k
C41 N044 N039 10p
R73 N033 N041 100k
C42 N049 N041 100n
Q11 N015 N007 N006 0 MMBTH81
Q12 N030 N021 N015 0 MMBTH81
R34 N030 0 1k
R35 N001 N006 10
V12 N001 0 12
R36 N007 N021 22k
R74 N027 N007 220
R75 N020 0 50
C28 N009 N020 100n
C43 N022 N030 100n
C44 N023 0 22p
D25 N003 N022 BAS40HM
D26 N022 N023 BAS40HM
R76 N023 N005 50
R77 N011 0 2.2k
Q13 N001 N005 N011 0 MMBT3904
D27 N001 N012 1N4148
D28 N012 N021 1N4148
C45 N001 N021 1µ
R78 N021 0 22k
R79 N011 N005 3.9k
XU7 N003 N024 N035 BFU760F  ; pins C B E
R80 N024 N011 10k
R81 0 N035 470
C46 N036 N035 100n
D29 0 N020 BAV99HM
D30 N020 0 BAV99HM
XU10 N003 N010 N026 BFU760F  ; pins C B E
R82 N010 N009 50
R83 0 N026 470
V13 N003 0 3
C47 N027 N026 100n
R84 N003 N009 10k
R85 N029 N007 1k
C48 N043 N029 10p
R86 N024 N034 100k
C49 N047 N034 100n
Q14 N085 N059 N057 0 MMBT3906
R87 N085 0 1k
R88 N051 N057 10
V16 N051 0 12
R89 N082 N059 220
R90 N070 0 50
C51 N064 N070 100n
C52 N075 N085 100n
C53 N076 0 22p
D31 N053 N075 BAS40HM
D32 N075 N076 BAS40HM
R91 N076 N055 50
R92 N066 0 2.2k
Q15 N051 N055 N066 0 MMBT3904
R93 N066 N055 3.9k
XU11 N053 N077 N090 BFU760F  ; pins C B E
R94 N077 N066 10k
R95 0 N090 470
C54 N091 N090 100n
D33 0 N070 BAV99HM
D34 N070 0 BAV99HM
XU12 N053 N065 N081 BFU760F  ; pins C B E
R96 N065 N064 50
R97 0 N081 470
V17 N053 0 3
C55 N082 N081 100n
R98 N053 N064 10k
R99 N084 N059 1k
C56 NC_02 N084 10p
R100 N077 N089 100k
C57 N093 N089 100n
R101 N059 N071 33k
D35 N051 N067 1N4148
D36 N067 N071 1N4148
C58 N051 N071 1µ
R102 N071 0 22k
V1 vin 0 PWL file=sig_in.csv
S1 0 N044 N048 0 MYSW
V2 N048 0 PULSE(0 1 10n 3n 3n 100n)
R1 N045 N044 10k
V3 N046 0 3
R2 0 N045 100
R3 N045 N046 330
C1 0 N045 100n
C2 0 N045 10µ
.model D D
.lib standard.dio
.model NPN NPN
.model PNP PNP
.lib standard.bjt
.include standard.bjt
.include standard_2.bjt
* output impedance approx 300 R
.model MYSW SW(Ron=1 Roff=1Meg Vt=.5 Vh=-.4)
* output impedance approx 300 R
.model MYSW SW(Ron=1 Roff=1Meg Vt=.5 Vh=-.4)
* output impedance approx 300 R
.model MYSW SW(Ron=1 Roff=1Meg Vt=.5 Vh=-.4)
* MMBT3906 cascode
* MMBTH81 cascode
* MMBTH81 single
* output impedance approx 300 R
* MMBT3906 single
.tran 0 {transtop} 0 {timestep}
.include param.txt
.include trancmd.txt
* do not edit this by hand
.lib BFU760F.txt
.backanno
.end